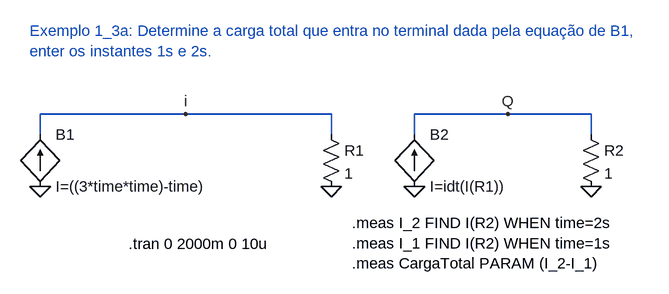
[diagram p0: schematic Exemplo1_3a.asc]
Exemplo1_3a.asc, the LTspice schematic file:
Version 4
SHEET 1 920 680
WIRE 128 64 -96 64
WIRE 352 64 128 64
WIRE 624 64 480 64
WIRE 752 64 624 64
WIRE -96 96 -96 64
WIRE 352 96 352 64
WIRE 480 96 480 64
WIRE 752 96 752 64
FLAG -96 176 0
FLAG 352 176 0
FLAG 128 64 i
FLAG 480 176 0
FLAG 752 176 0
FLAG 624 64 Q
SYMBOL res 336 80 R0
SYMATTR InstName R1
SYMATTR Value 1
SYMBOL res 736 80 R0
SYMATTR InstName R2
SYMATTR Value 1
SYMBOL bi 480 176 M180
WINDOW 0 24 80 Left 2
WINDOW 3 24 0 Left 2
SYMATTR InstName B2
SYMATTR Value I=idt(I(R1))
SYMBOL bi -96 176 M180
WINDOW 0 24 80 Left 2
WINDOW 3 24 0 Left 2
SYMATTR InstName B1
SYMATTR Value I=((3*time*time)-time)
TEXT 40 264 Left 2 !.tran 0 2000m 0 10u
TEXT -112 -64 Left 2 ;Exemplo 1_3a: Determine a carga total que entra no terminal dada pela equação de B1, \nenter os instantes 1s e 2s.
TEXT 384 232 Left 2 !.meas I_2 FIND I(R2) WHEN time=2s\n.meas I_1 FIND I(R2) WHEN time=1s\n.meas CargaTotal PARAM (I_2-I_1)

The netlist it stands for:
* Exemplo1_3a.asc
R1 i 0 1
R2 Q 0 1
B2 0 Q I=idt(I(R1))
B1 0 i I=((3*time*time)-time)
.tran 0 2000m 0 10u
* Exemplo 1_3a: Determine a carga total que entra no terminal dada pela equação de B1,
* enter os instantes 1s e 2s.
.meas I_2 FIND I(R2) WHEN time=2s
.meas I_1 FIND I(R2) WHEN time=1s
.meas CargaTotal PARAM (I_2-I_1)
.backanno
.end